# EAGLE design shifter-module (EAGLE 5.11)
DRAWN_BY: Alexios; PROJECT_NAME: CFT Mini-Computer; REVISION: Rev B; SHEET_DESCRIPTION: Bus Connectors; SIMULATION_FILENAME: N/A; URL: http://www.bedroomlan.org/cft
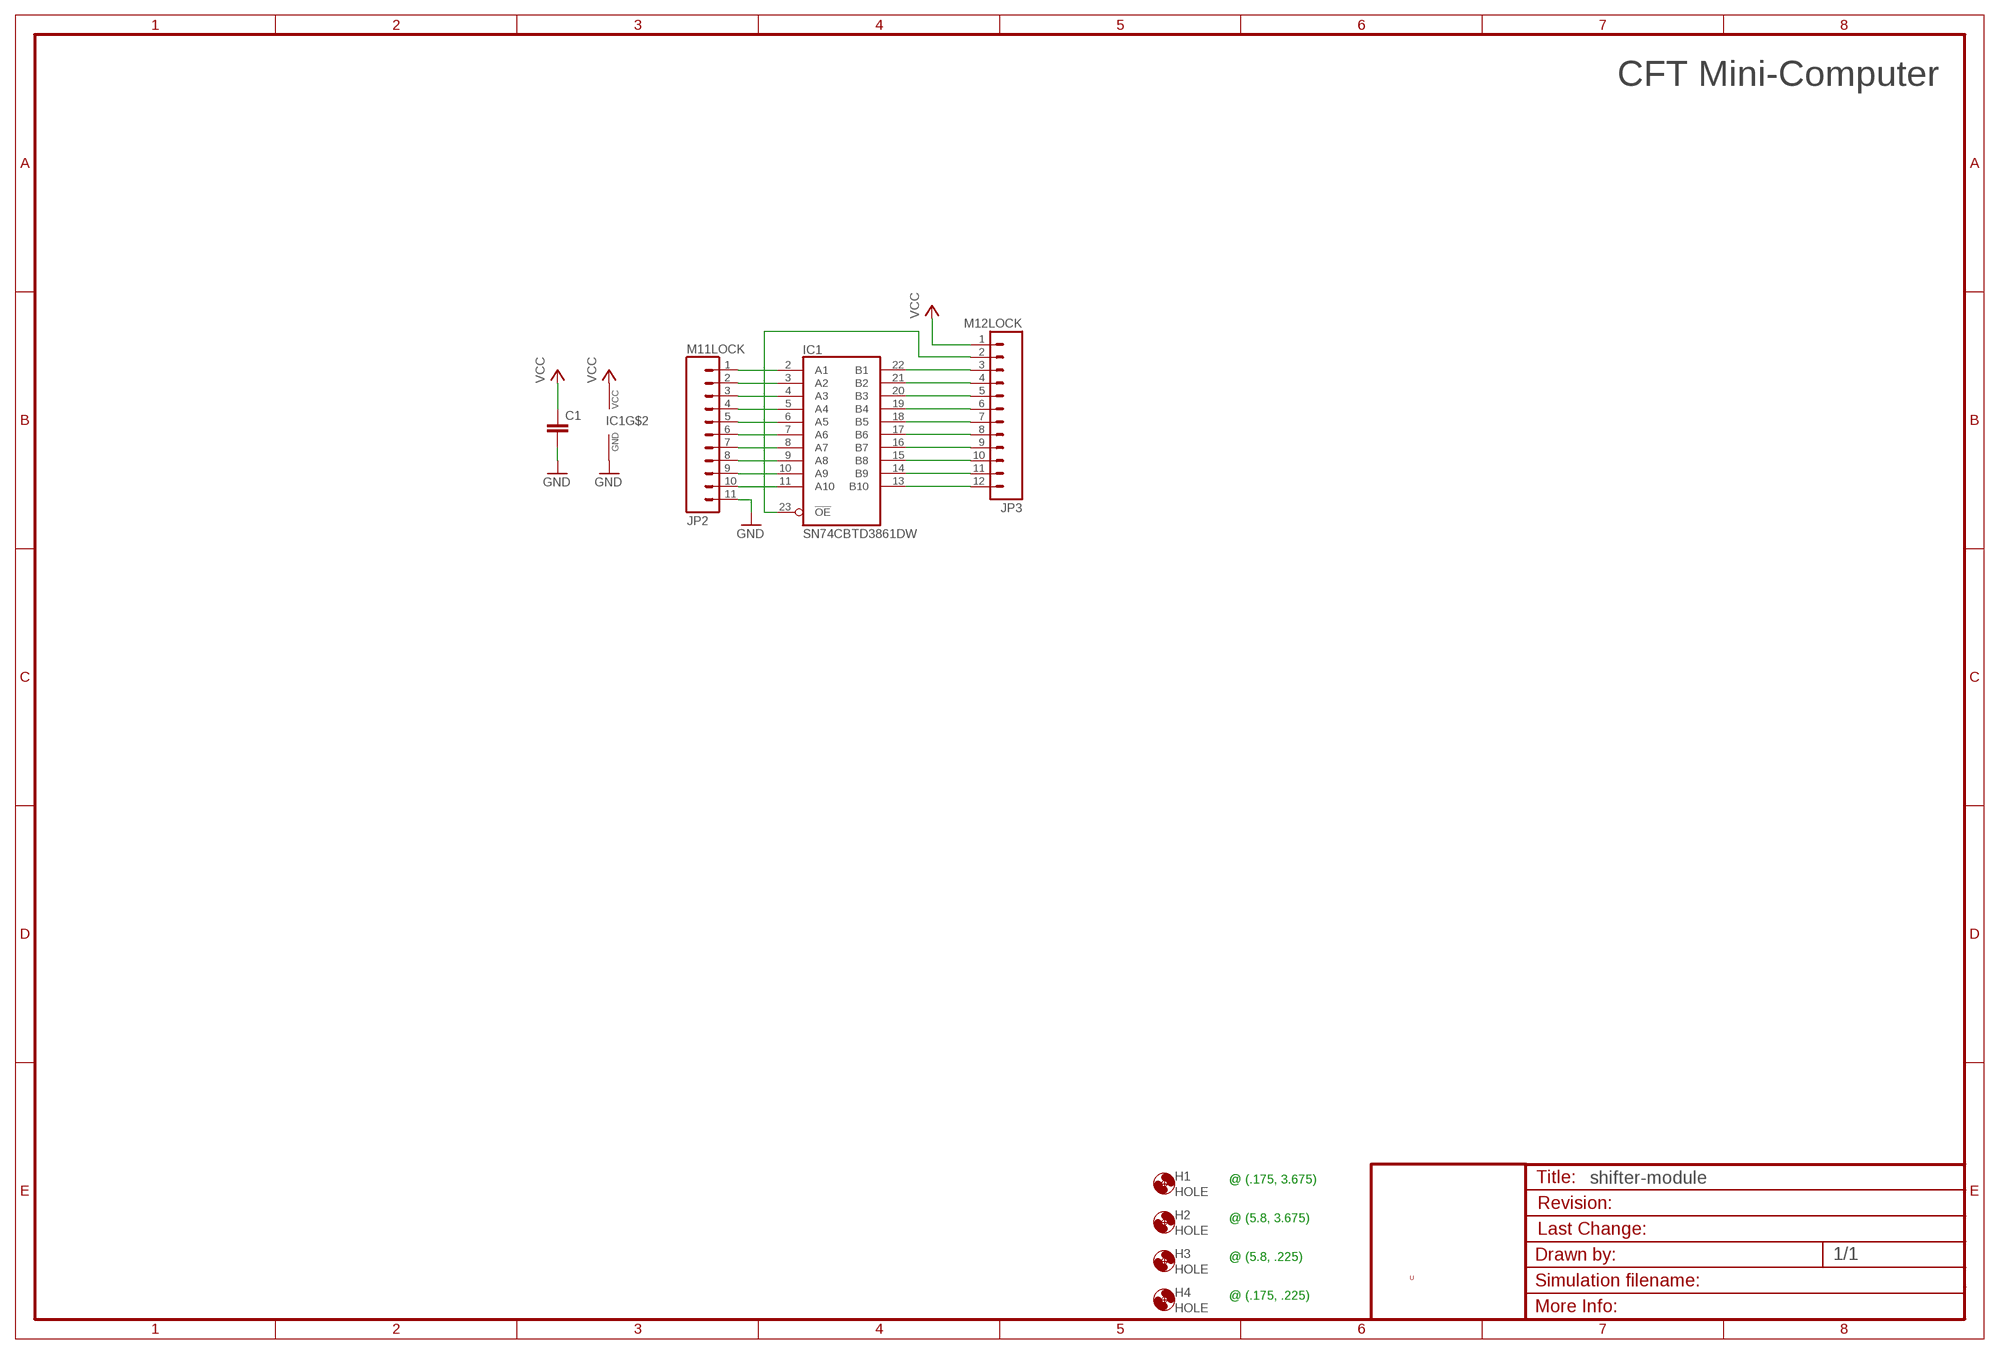
[diagram p0: schematic, sheet 1]

## Parts
C1  C-EUC1206  [C1206]
H1  HOLE  [STANDOFF_28_60]
H2  HOLE  [STANDOFF_28_60]
H3  HOLE  [STANDOFF_28_60]
H4  HOLE  [STANDOFF_28_60]
IC1  SN74CBTD3861DW  [SO24W]
JP2  M11LOCK  [1X11_LOCK]
JP3  M12LOCK  [1X12_LOCK]

## Nets
GND [low power]: C1.2 IC1.12(GND) JP2.11
N$1: IC1.2(A1) JP2.1
N$2: IC1.3(A2) JP2.2
N$3: IC1.4(A3) JP2.3
N$4: IC1.5(A4) JP2.4
N$5: IC1.6(A5) JP2.5
N$6: IC1.7(A6) JP2.6
N$7: IC1.8(A7) JP2.7
N$8: IC1.9(A8) JP2.8
N$9: IC1.10(A9) JP2.9
N$10: IC1.11(A10) JP2.10
N$11: IC1.13(B10) JP3.12
N$12: IC1.14(B9) JP3.11
N$13: IC1.15(B8) JP3.10
N$14: IC1.16(B7) JP3.9
N$15: IC1.17(B6) JP3.8
N$16: IC1.18(B5) JP3.7
N$17: IC1.19(B4) JP3.6
N$18: IC1.20(B3) JP3.5
N$19: IC1.21(B2) JP3.4
N$20: IC1.22(B1) JP3.3
N$22: IC1.23(!OE) JP3.2
VCC [low power]: C1.1 IC1.24(VCC) JP3.1

## Notes on the sheet
- CFT Mini-Computer
- @ (.175, 3.675)
- @ (5.8, 3.675)
- @ (5.8, .225)
- U
- @ (.175, .225)

## Library data of the parts
C1 = rcl:C-EU: CAPACITOR, European symbol
H1-H4 = alexios:HOLE: Hole for a standoff or mount. Hole diameter: 3.3mm. External Diameter: 6mm.
IC1 = alexios:SN74CBTD3861: 10-bit FET Bus Switch with Level Shifting. 5? switch connection between two ports. TTL-Compatible input levels. Designed to be used in level-shifting applications. Bidirectional without direction pins. Datasheet: http://www.farnell.com/datasheets/1446664.pdf Farnell: 1750323 <http://uk.farnell.com/texas-instruments/sn74cbtd3861dw/logic-10-bit-fet-bus-sw-24soic/dp/1750323>
JP2 = SparkFun:M11: Header 11 Standard 11-pin 0.1" header. Use with straight break away headers (SKU : PRT-00116), right angle break away headers (PRT-00553), swiss pins (PRT-00743), machine pins (PRT-00117), and female headers (PRT-00115).
JP3 = SparkFun:M12: Header 12 Standard 12-pin 0.1" header. Use with straight break away headers (SKU : PRT-00116), right angle break away headers (PRT-00553), swiss pins (PRT-00743), machine pins (PRT-00117), and female headers (PRT-00115).

## Net classes
0 default: width 0.305 mm, clearance 0.203 mm
1 low power: width 1.27 mm, clearance 0.254 mm
2 LED power: width 1.93 mm, clearance 0.254 mm

## Board
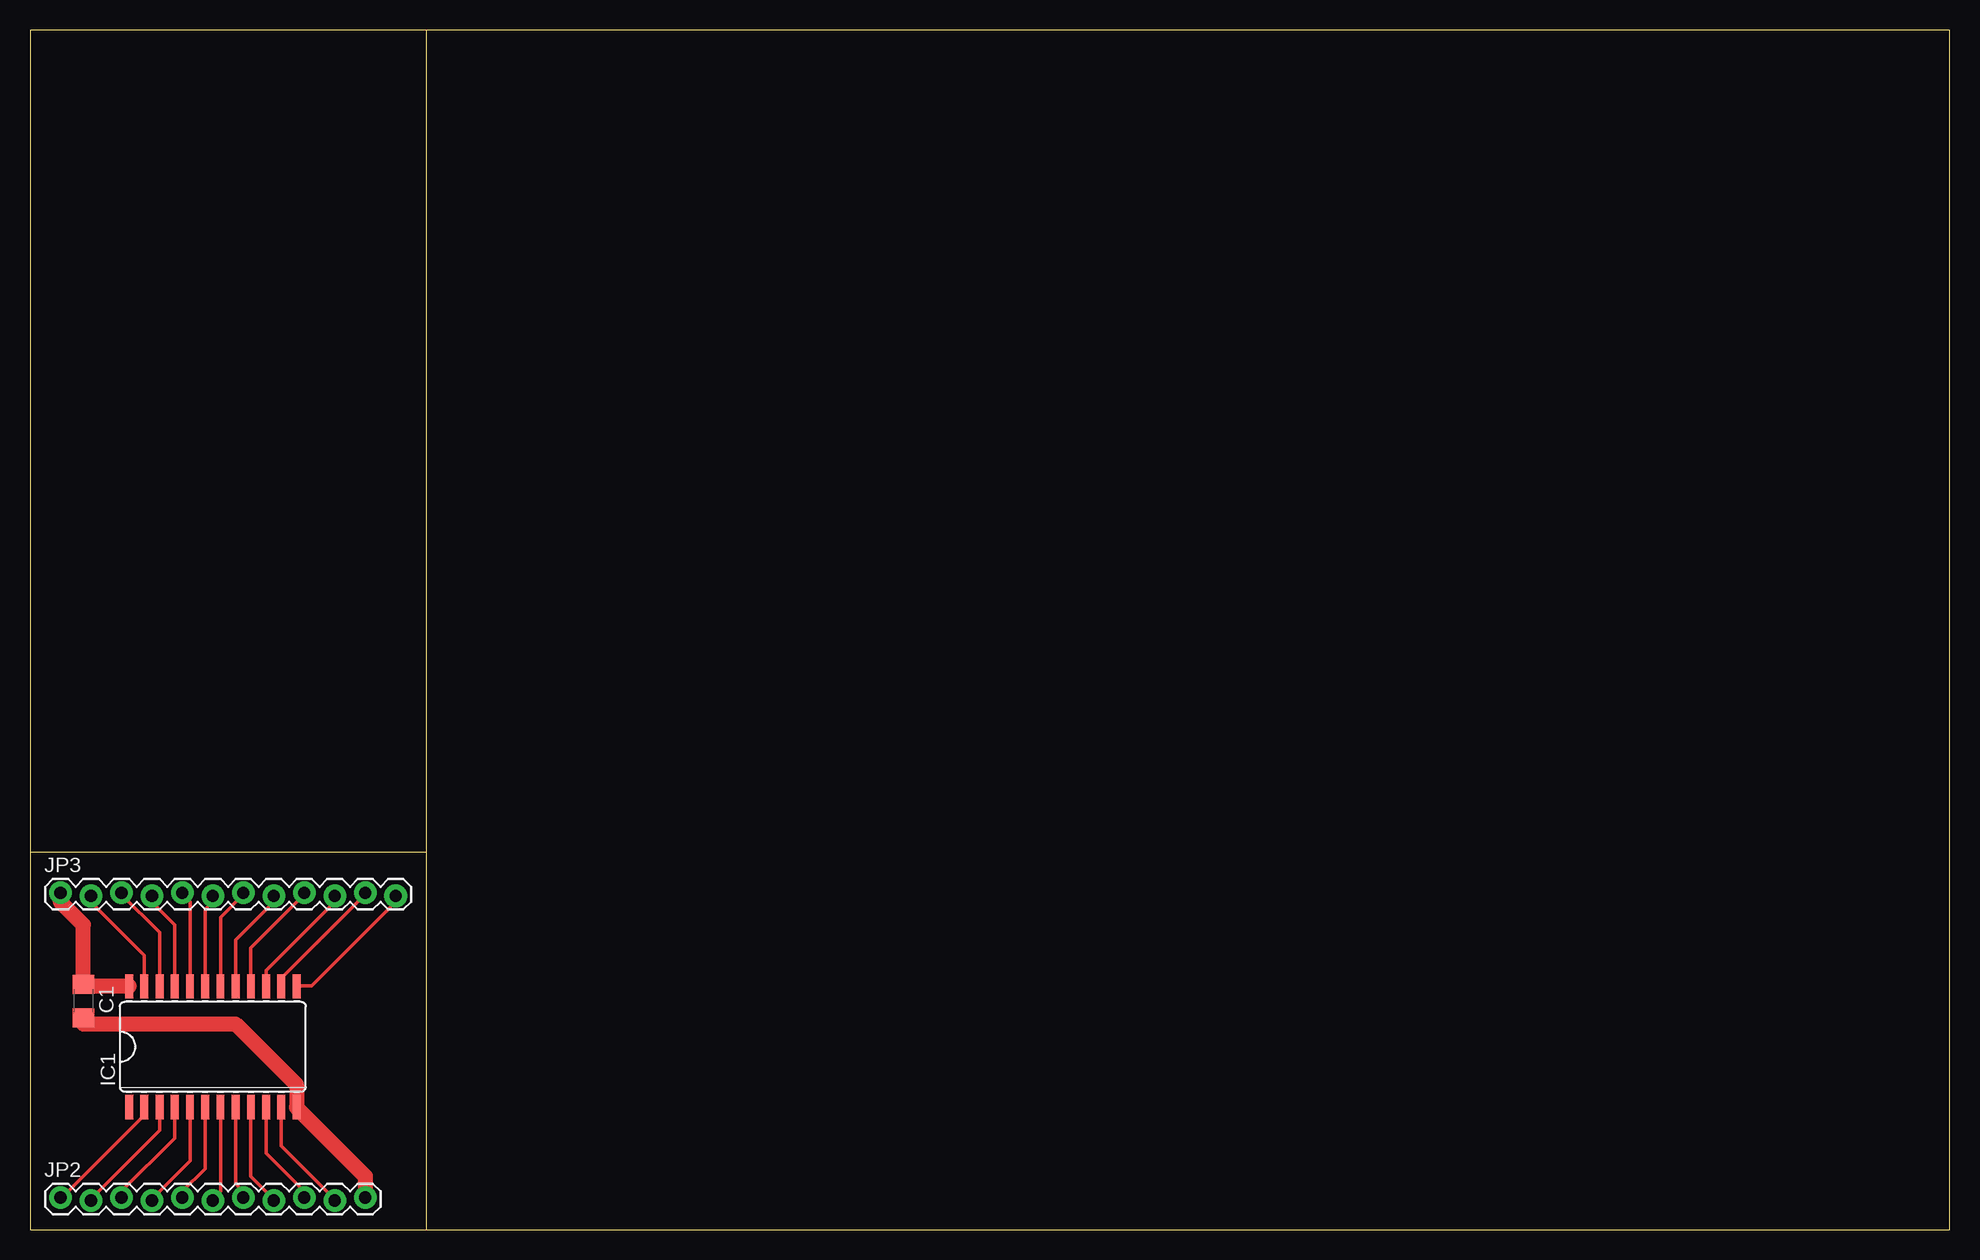
[diagram p1: board, top side]

Size 160 x 100 mm. Coordinates in mm from the lower left corner, seen from the top.
Outline: 33.02,0 0,0 0,31.42
Outline: 33.02,0 160,0 160,100 33.02,100
Outline: 33.02,100 0,100 0,31.42
Outline: 33.02,100 33.02,31.42
Outline: 33.02,31.42 33.02,26.34 33.02,0
Outline: 33.02,31.42 0,31.42
Copper layers (1*16): Top 0.035mm / dielectric 1.5mm / Bottom 0.035mm
Design rules "default": minimum track width 10mil, minimum drill 24mil, track to track 8mil, track to pad 8mil, pad to pad 8mil, via to via 8mil, smd to smd 8mil, copper to edge 40mil, drill to drill 8mil, minimum pad ring 10mil, minimum via ring 8mil, stop-mask expansion 4mil, vias tented up to drill 0mil, thermal gap 10mil

### Footprints (pad centres in the part's own frame; a part is rotated, then mirrored left to right if it is on the bottom)
C1206 = smd 1.6 x 1.8: 1 -1.4,0; 2 1.4,0
STANDOFF_28_60 = hole 3.302: 0,0
SO24W = smd 0.66 x 2.032: 1 -6.985,-5.029; 2 -5.715,-5.029; 3 -4.445,-5.029; 4 -3.175,-5.029; 5 -1.905,-5.029; 6 -0.635,-5.029; 7 0.635,-5.029; 8 1.905,-5.029; 9 3.175,-5.029; 10 4.445,-5.029; 11 5.715,-5.029; 12 6.985,-5.029; 13 6.985,5.029; 14 5.715,5.029; 15 4.445,5.029; 16 3.175,5.029; 17 1.905,5.029; 18 0.635,5.029; 19 -0.635,5.029; 20 -1.905,5.029; 21 -3.175,5.029; 22 -4.445,5.029; 23 -5.715,5.029; 24 -6.985,5.029
1X11_LOCK = drill 1.016 pad 1.88 round: 1 0,0.127; 2 2.54,-0.127; 3 5.08,0.127; 4 7.62,-0.127; 5 10.16,0.127; 6 12.7,-0.127; 7 15.24,0.127; 8 17.78,-0.127; 9 20.32,0.127; 10 22.86,-0.127; 11 25.4,0.127
1X12_LOCK = drill 1.016 pad 1.88 round: 1 0,0.127; 2 2.54,-0.127; 3 5.08,0.127; 4 7.62,-0.127; 5 10.16,0.127; 6 12.7,-0.127; 7 15.24,0.127; 8 17.78,-0.127; 9 20.32,0.127; 10 22.86,-0.127; 11 25.4,0.127; 12 27.94,-0.127

### Placement (x,y rotation side)
C1  4.45,19.05 270 top
H1  -146.05,142.24 0 top  (outside the outline)
H2  -152.4,142.24 0 top  (outside the outline)
H3  -158.75,142.24 0 top  (outside the outline)
H4  -165.1,142.24 0 top  (outside the outline)
IC1  15.24,15.24 0 top
JP2  2.54,2.54 0 top
JP3  2.54,27.94 0 top

### Tracks (layer width: path | path; a pad name or v marks a point on that pad's centre or on a via)
GND
  Top 1.27: C1.2 4.45,17.14 17.14,17.14 22.23,12.06 IC1.12 22.23,10.16 27.94,4.45 JP2.11
N$1
  Top 0.305: IC1.2 9.53,9.53 2.54,2.54 JP2.1
N$2
  Top 0.305: IC1.3 10.79,8.26 5.08,2.54 JP2.2
N$3
  Top 0.305: IC1.4 12.06,7.62 7.62,3.17 JP2.3
N$4
  Top 0.305: IC1.5 13.34,5.71 10.16,2.54 JP2.4
N$5
  Top 0.305: IC1.6 14.61,5.08 12.7,3.17 JP2.5
N$6
  Top 0.305: IC1.7 15.88,3.17 15.24,2.54 JP2.6
N$7
  Top 0.305: IC1.8 17.14,3.81 17.78,3.17 JP2.7
N$8
  Top 0.305: IC1.9 18.41,4.45 20.32,2.54 JP2.8
N$9
  Top 0.305: IC1.10 19.68,6.35 22.86,3.17 JP2.9
N$10
  Top 0.305: IC1.11 20.95,6.99 25.4,2.54 JP2.10
N$11
  Top 0.305: IC1.13 22.23,20.32 23.5,20.32 30.48,27.3 JP3.12
N$12
  Top 0.305: IC1.14 20.95,20.95 27.94,27.94 JP3.11
N$13
  Top 0.305: IC1.15 19.68,21.59 25.4,27.3 JP3.10
N$14
  Top 0.305: IC1.16 18.41,23.5 22.86,27.94 JP3.9
N$15
  Top 0.305: IC1.17 17.14,24.13 20.32,27.3 JP3.8
N$16
  Top 0.305: IC1.18 15.88,26.04 17.78,27.94 JP3.7
N$17
  Top 0.305: IC1.19 14.61,26.67 15.24,27.3 JP3.6
N$18
  Top 0.305: IC1.20 13.34,27.3 12.7,27.94 JP3.5
N$19
  Top 0.305: IC1.21 12.06,25.4 10.16,27.3 JP3.4
N$20
  Top 0.305: IC1.22 10.79,24.77 7.62,27.94 JP3.3
N$22
  Top 0.305: IC1.23 9.53,22.86 5.08,27.3 JP3.2
VCC
  Top 1.27: IC1.24 8.26,20.32 4.45,20.32 C1.1 4.45,25.4 2.54,27.3 JP3.1